# Altium project PCB_Project_2.PrjPcb
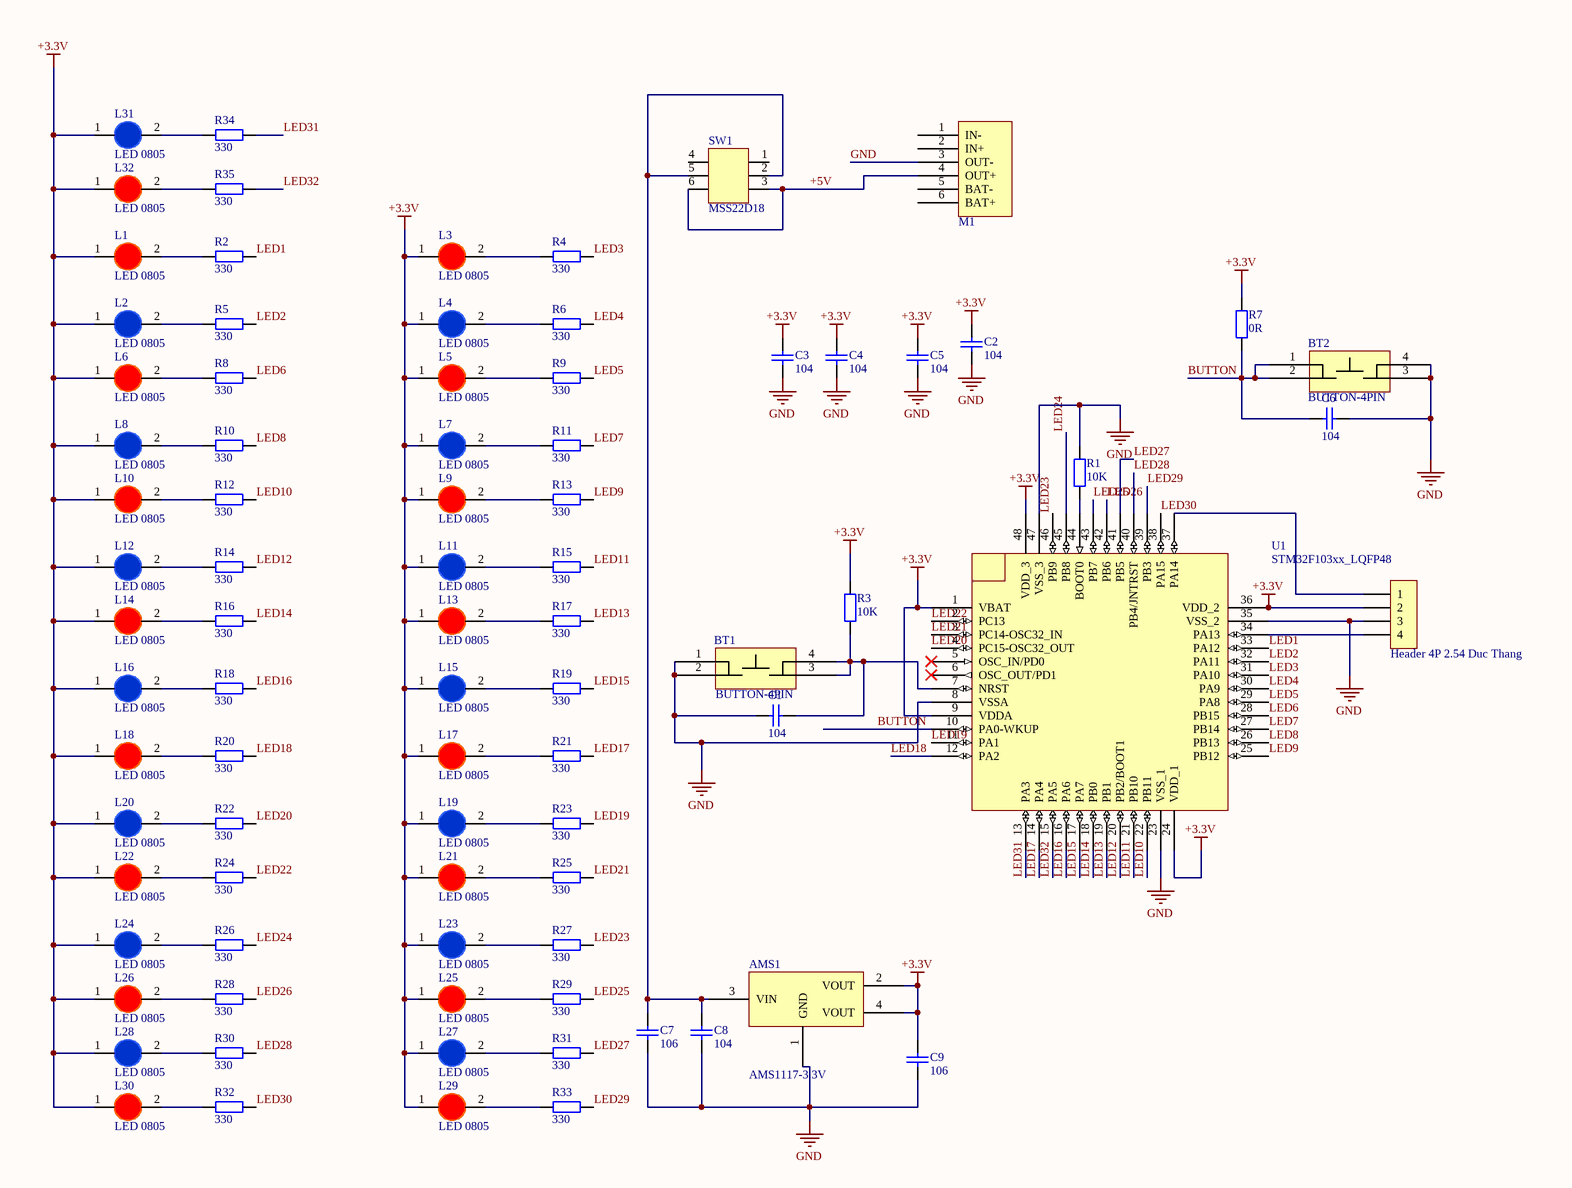
[diagram p0: Sheet1.SchDoc]
1 sheet, 83 parts. Net scope: global (net labels, ports and power ports of the same name join across sheets).
Board file: PCB1.PcbDoc

## Sheet Sheet1.SchDoc
size A3; SheetNumber: 1; SheetTotal: 1

### Parts
AMS1  AMS1117-3.3V  [SOT223]
BT1  BUTTON-4PIN  [BUTTON-3X3X1.5-4PIN]
BT2  BUTTON-4PIN  [BUTTON-3X3X1.5-4PIN]
C1  104  [tu 0603]
C2  104  [tu 0603]
C3  104  [tu 0603]
C4  104  [tu 0603]
C5  104  [tu 0603]
C6  104  [tu 0603]
C7  106  [tu 0603]
C8  104  [tu 0603]
C9  106  [tu 0603]
H1  Header 4P 2.54 Duc Thang  [XH2.54M-4]
L1  LED 0805  [LED-0805-Red]
L2  LED 0805  [LED-0805-Blue]
L3  LED 0805  [LED-0805-Red]
L4  LED 0805  [LED-0805-Blue]
L5  LED 0805  [LED-0805-Red]
L6  LED 0805  [LED-0805-Red]
L7  LED 0805  [LED-0805-Blue]
L8  LED 0805  [LED-0805-Blue]
L9  LED 0805  [LED-0805-Red]
L10  LED 0805  [LED-0805-Red]
L11  LED 0805  [LED-0805-Blue]
L12  LED 0805  [LED-0805-Blue]
L13  LED 0805  [LED-0805-Red]
L14  LED 0805  [LED-0805-Red]
L15  LED 0805  [LED-0805-Blue]
L16  LED 0805  [LED-0805-Blue]
L17  LED 0805  [LED-0805-Red]
L18  LED 0805  [LED-0805-Red]
L19  LED 0805  [LED-0805-Blue]
L20  LED 0805  [LED-0805-Blue]
L21  LED 0805  [LED-0805-Red]
L22  LED 0805  [LED-0805-Red]
L23  LED 0805  [LED-0805-Blue]
L24  LED 0805  [LED-0805-Blue]
L25  LED 0805  [LED-0805-Red]
L26  LED 0805  [LED-0805-Red]
L27  LED 0805  [LED-0805-Blue]
L28  LED 0805  [LED-0805-Blue]
L29  LED 0805  [LED-0805-Red]
L30  LED 0805  [LED-0805-Red]
L31  LED 0805  [LED-0805-Blue]
L32  LED 0805  [LED-0805-Red]
M1  MODULE-TP4056  [MODULE-TP4056]  (value not drawn)
R1  10K  [tro smd 0603]
R2  330  [tro smd 0603]
R3  10K  [tro smd 0603]
R4  330  [tro smd 0603]
R5  330  [tro smd 0603]
R6  330  [tro smd 0603]
R7  0R  [tro smd 0603]
R8  330  [tro smd 0603]
R9  330  [tro smd 0603]
R10  330  [tro smd 0603]
R11  330  [tro smd 0603]
R12  330  [tro smd 0603]
R13  330  [tro smd 0603]
R14  330  [tro smd 0603]
R15  330  [tro smd 0603]
R16  330  [tro smd 0603]
R17  330  [tro smd 0603]
R18  330  [tro smd 0603]
R19  330  [tro smd 0603]
R20  330  [tro smd 0603]
R21  330  [tro smd 0603]
R22  330  [tro smd 0603]
R23  330  [tro smd 0603]
R24  330  [tro smd 0603]
R25  330  [tro smd 0603]
R26  330  [tro smd 0603]
R27  330  [tro smd 0603]
R28  330  [tro smd 0603]
R29  330  [tro smd 0603]
R30  330  [tro smd 0603]
R31  330  [tro smd 0603]
R32  330  [tro smd 0603]
R33  330  [tro smd 0603]
R34  330  [tro smd 0603]
R35  330  [tro smd 0603]
SW1  MSS22D18  [MSS22D18 SMD]
U1  STM32F103xx_LQFP48  [STM32_LQPF48]

### Nets
+3.3V: AMS1.2(VOUT) AMS1.4(VOUT) C2.2 C3.2 C4.2 C5.2 C9.1 H1.2 L1.1(A) L2.1(A) L3.1(A) L4.1(A) L5.1(A) L6.1(A) L7.1(A) L8.1(A) L9.1(A) L10.1(A) L11.1(A) L12.1(A) L13.1(A) L14.1(A) L15.1(A) L16.1(A) L17.1(A) L18.1(A) L19.1(A) L20.1(A) L21.1(A) L22.1(A) L23.1(A) L24.1(A) L25.1(A) L26.1(A) L27.1(A) L28.1(A) L29.1(A) L30.1(A) L31.1(A) L32.1(A) R3.2 R7.2 U1.1(VBAT) U1.9(VDDA) U1.24(VDD_1) U1.36(VDD_2) U1.48(VDD_3)
GND: AMS1.1(GND) BT1.1 BT1.2 BT2.3 BT2.4 C1.1 C2.1 C3.1 C4.1 C5.1 C6.2 C7.2 C8.1 C9.2 H1.3 M1.3(OUT-) R1.2 U1.8(VSSA) U1.23(VSS_1) U1.35(VSS_2) U1.47(VSS_3)
+5V: M1.4(OUT+) SW1.3 SW1.6
BUTTON: BT2.1 BT2.2 C6.1 R7.1 U1.10(PA0-WKUP)
LED1: R2.2 U1.33(PA12)
LED2: R5.2 U1.32(PA11)
LED3: R4.2 U1.31(PA10)
LED4: R6.2 U1.30(PA9)
LED5: R9.2 U1.29(PA8)
LED6: R8.2 U1.28(PB15)
LED7: R11.2 U1.27(PB14)
LED8: R10.2 U1.26(PB13)
LED9: R13.2 U1.25(PB12)
LED10: R12.2 U1.22(PB11)
LED11: R15.2 U1.21(PB10)
LED12: R14.2 U1.20(PB2/BOOT1)
LED13: R17.2 U1.19(PB1)
LED14: R16.2 U1.18(PB0)
LED15: R19.2 U1.17(PA7)
LED16: R18.2 U1.16(PA6)
LED17: R21.2 U1.14(PA4)
LED18: R20.2 U1.12(PA2)
LED19: R23.2 U1.11(PA1)
LED20: R22.2 U1.4(PC15-OSC32_OUT)
LED21: R25.2 U1.3(PC14-OSC32_IN)
LED22: R24.2 U1.2(PC13)
LED23: R27.2 U1.46(PB9)
LED24: R26.2 U1.45(PB8)
LED25: R29.2 U1.43(PB7)
LED26: R28.2 U1.42(PB6)
LED27: R31.2 U1.41(PB5)
LED28: R30.2 U1.40(PB4/JNTRST)
LED29: R33.2 U1.39(PB3)
LED30: R32.2 U1.38(PA15)
LED31: R34.2 U1.13(PA3)
LED32: R35.2 U1.15(PA5)
NetAMS1_3: AMS1.3(VIN) C7.1 C8.2 SW1.2 SW1.5
NetBT1_3: BT1.3 BT1.4 C1.2 R3.1 U1.7(NRST)
NetH1_1: H1.1 U1.37(PA14)
NetH1_4: H1.4 U1.34(PA13)
NetL1_2: L1.2(K) R2.1
NetL2_2: L2.2(K) R5.1
NetL3_2: L3.2(K) R4.1
NetL4_2: L4.2(K) R6.1
NetL5_2: L5.2(K) R9.1
NetL6_2: L6.2(K) R8.1
NetL7_2: L7.2(K) R11.1
NetL8_2: L8.2(K) R10.1
NetL9_2: L9.2(K) R13.1
NetL10_2: L10.2(K) R12.1
NetL11_2: L11.2(K) R15.1
NetL12_2: L12.2(K) R14.1
NetL13_2: L13.2(K) R17.1
NetL14_2: L14.2(K) R16.1
NetL15_2: L15.2(K) R19.1
NetL16_2: L16.2(K) R18.1
NetL17_2: L17.2(K) R21.1
NetL18_2: L18.2(K) R20.1
NetL19_2: L19.2(K) R23.1
NetL20_2: L20.2(K) R22.1
NetL21_2: L21.2(K) R25.1
NetL22_2: L22.2(K) R24.1
NetL23_2: L23.2(K) R27.1
NetL24_2: L24.2(K) R26.1
NetL25_2: L25.2(K) R29.1
NetL26_2: L26.2(K) R28.1
NetL27_2: L27.2(K) R31.1
NetL28_2: L28.2(K) R30.1
NetL29_2: L29.2(K) R33.1
NetL30_2: L30.2(K) R32.1
NetL31_2: L31.2(K) R34.1
NetL32_2: L32.2(K) R35.1
NetR1_1: R1.1 U1.44(BOOT0)

Not connected (* = marked no-connect by the designer): M1 1(IN-) 2(IN+) 5(BAT-) 6(BAT+); SW1 1(77) 4; U1 5(OSC_IN/PD0)* 6(OSC_OUT/PD1)*

### Library data of the parts
AMS1 = AMS1117 SMD: Dán; Value: AMS1117-3.3V SOT223; Don_Vi: Con; Ma_Hang: MH000596; Ghi_Chu: *; Kieu_Chan: *; Chung_Loai: Dán
C1-C6 C8 = Tu 0603 104 50V 10%: Dán; Don_Vi: Con; So_Chan: 2; Ten_Linh_Kien: Tụ 0603 104-100nF 10% 50V; Ma_Hang: MH004568; Chung_Loai: Dán; Kieu_Chan: *
C7 C9 = Tu 0603 106 16V 20%: Dán; Don_Vi: Con; So_Chan: 2; Ten_Linh_Kien: Tụ 0603-10uF 20% 16V; Ma_Hang: MH004848; Chung_Loai: Dán; Kieu_Chan: *
H1 = Header 4P 2.54 Duc Thang: Cắm; Ten_Linh_Kien: Header 4P XH2.54-4P Đực Thẳng; Don_Vi: Con; Ma_Hang: MH001285; Chung_Loai: Cắm
L1 L3 L5 L6 L9 L10 L13 L14 L17 L18 L21 L22 L25 L26 L29 L30 L32 = LED 0805 Do: Dán; Don_Vi: Con; Ma_Hang: MH000897; Ten_Linh_Kien: LED 0805 Màu Đỏ (Red); Ghi_Chu: *; Kieu_Chan: *; Chung_Loai: Dán
L2 L4 L7 L8 L11 L12 L15 L16 L19 L20 L23 L24 L27 L28 L31 = LED 0805 Xanh Duong: Dán; Don_Vi: Con; Ma_Hang: MH002327; Ten_Linh_Kien: LED 0805 Màu Xanh Dương (Blue); Ghi_Chu: *; Kieu_Chan: *; Chung_Loai: Dán
R1-R35 = Tro 0603 1% 0R: Dán; Don_Vi: Con; So_Chan: 2; Ten_Linh_Kien: Trở 0603 1% 0R; Ma_Hang: MH005792; Chung_Loai: Dán; Kieu_Chan: *
SW1 = MSS22D18: SMD
U1 = STM32F103xx_LQFP48: Published: 30-May-2008; DatasheetVersion: rev6, Mar-2008; PackageVersion: Mar-2008; PackageReference: LQFP48; Publisher: Altium Limited; PackageDescription: 48-Pin Low-Profile Quad Flat Pack, 7 x 7 mm Body, 0.5 mm Pitch (LQFP48); ComponentLink1Description: Manufacturer Link; ComponentLink1URL: www.st.com/stm32; ComponentLink2Description: Datasheet; ComponentLink2URL: http://www.st.com/stonline/products/literature/ds/13587.pdf